# Altium schematic sheet IMU.SchDoc
size A4; SheetNumber: 9; SheetTotal: 9
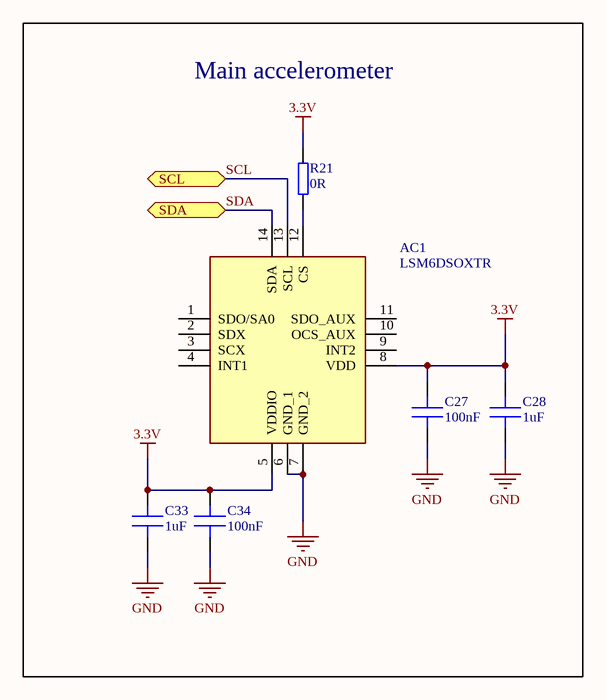
[diagram p0: IMU.SchDoc]

## Parts
AC1  LSM6DSOXTR  [LGA-14_1]
C27  100nF  [C 0402]
C28  1uF  [C 0402]
C33  1uF  [C 0402]
C34  100nF  [C 0402]
R21  0R  [R 0402]

## Blocks framed on the sheet
Main accelerometer: AC1 C27 C28 C33 C34 R21

## Ports
SCL (bidir), SDA (bidir)

## Nets
3.3V: AC1.5(VDDIO) AC1.8(VDD) C27.1 C28.1 C33.1 C34.1 R21.2
GND: AC1.6(GND_1) AC1.7(GND_2) C27.2 C28.2 C33.2 C34.2
SCL: AC1.13(SCL) ; port SCL
SDA: AC1.14(SDA) ; port SDA
NetAC1_12: AC1.12(CS) R21.1

Not connected (* = marked no-connect by the designer): AC1 1(SDO/SA0) 2(SDX) 3(SCX) 4(INT1) 9(INT2) 10(OCS_AUX) 11(SDO_AUX)

## Library data of the parts
AC1 = LSM6DSOXTR: Accelerometer; Manufacturer_Name: STMicroelectronics; Datasheet Link: https://www.st.com/resource/en/datasheet/lsm6dsox.pdf; Manufacturer_Part_Number: LSM6DSOXTR; Mouser Part Number: 511-LSM6DSOXTR; Mouser Price/Stock: https://www.mouser.co.uk/ProductDetail/STMicroelectronics/LSM6DSOXTR?qs=l7cgNqFNU1i9dcjzItLpVQ%3D%3D; Arrow Part Number: LSM6DSOXTR; Arrow Price/Stock: https://www.arrow.com/en/products/lsm6dsoxtr/stmicroelectronics?region=europe
C27 C28 C33 C34 = Capacitor: MLCC Capacitor
R21 = Resistor: General pourpouse resistor